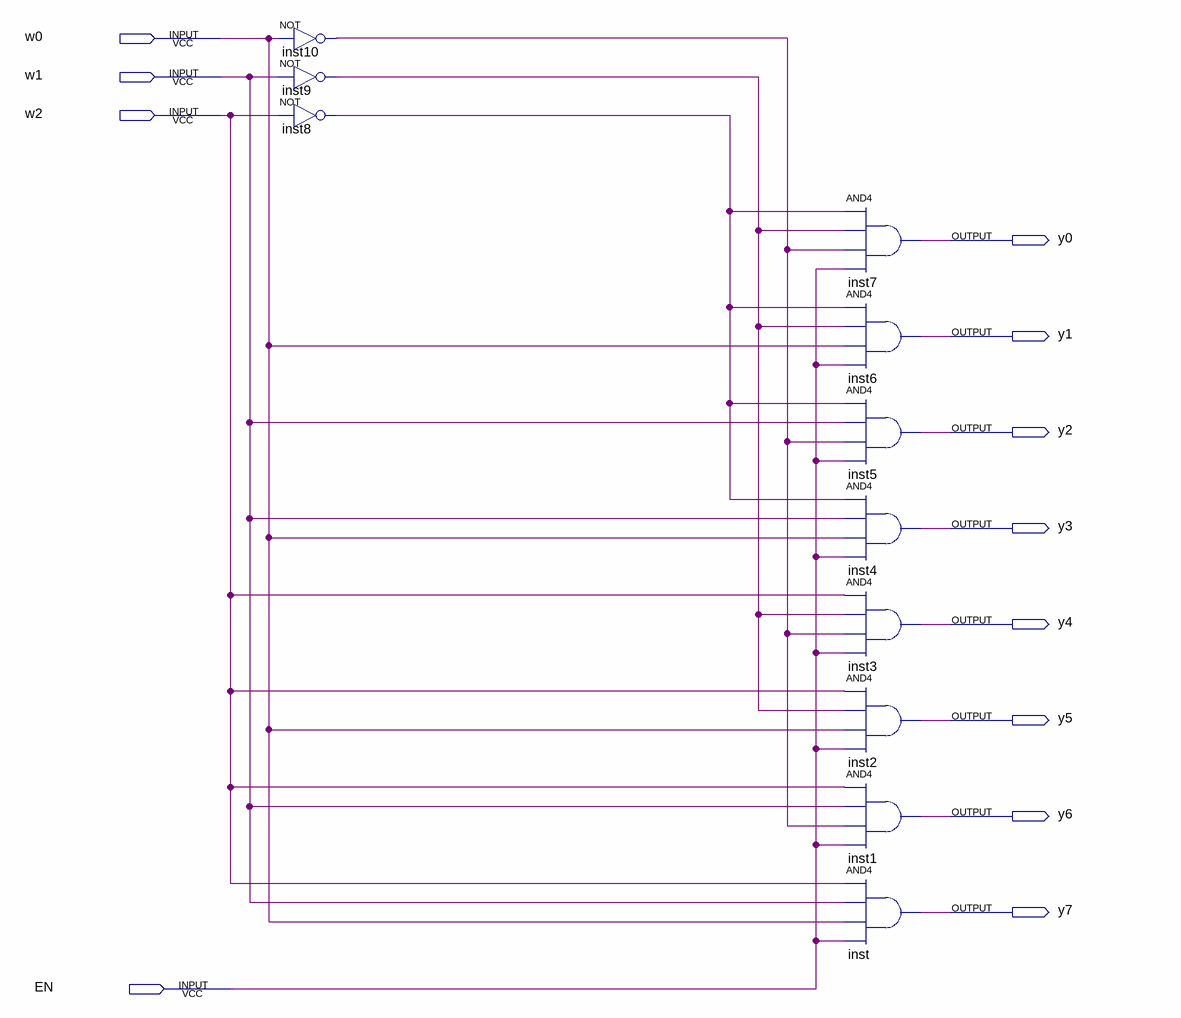
[diagram p0: schematic sheet]
// Quartus schematic dec3to8.bdf as structural Verilog: 11 symbols, 12 pins
module dec3to8 (
  input  w0,
  input  w1,
  input  w2,
  input  EN,
  output y0,
  output y1,
  output y2,
  output y3,
  output y4,
  output y5,
  output y6,
  output y7
);

  wire inst8_out, inst9_out, inst10_out;

  not inst10 (inst10_out, w0);
  not inst9 (inst9_out, w1);
  not inst8 (inst8_out, w2);
  and inst7 (y0, inst8_out, inst9_out, inst10_out, EN);
  and inst6 (y1, inst8_out, inst9_out, w0, EN);
  and inst5 (y2, inst8_out, w1, inst10_out, EN);
  and inst4 (y3, inst8_out, w1, w0, EN);
  and inst3 (y4, w2, inst9_out, inst10_out, EN);
  and inst2 (y5, w2, inst9_out, w0, EN);
  and inst1 (y6, w2, w1, inst10_out, EN);
  and inst (y7, w2, w1, w0, EN);
endmodule
